# EAGLE design edubrm (EAGLE 5.11)
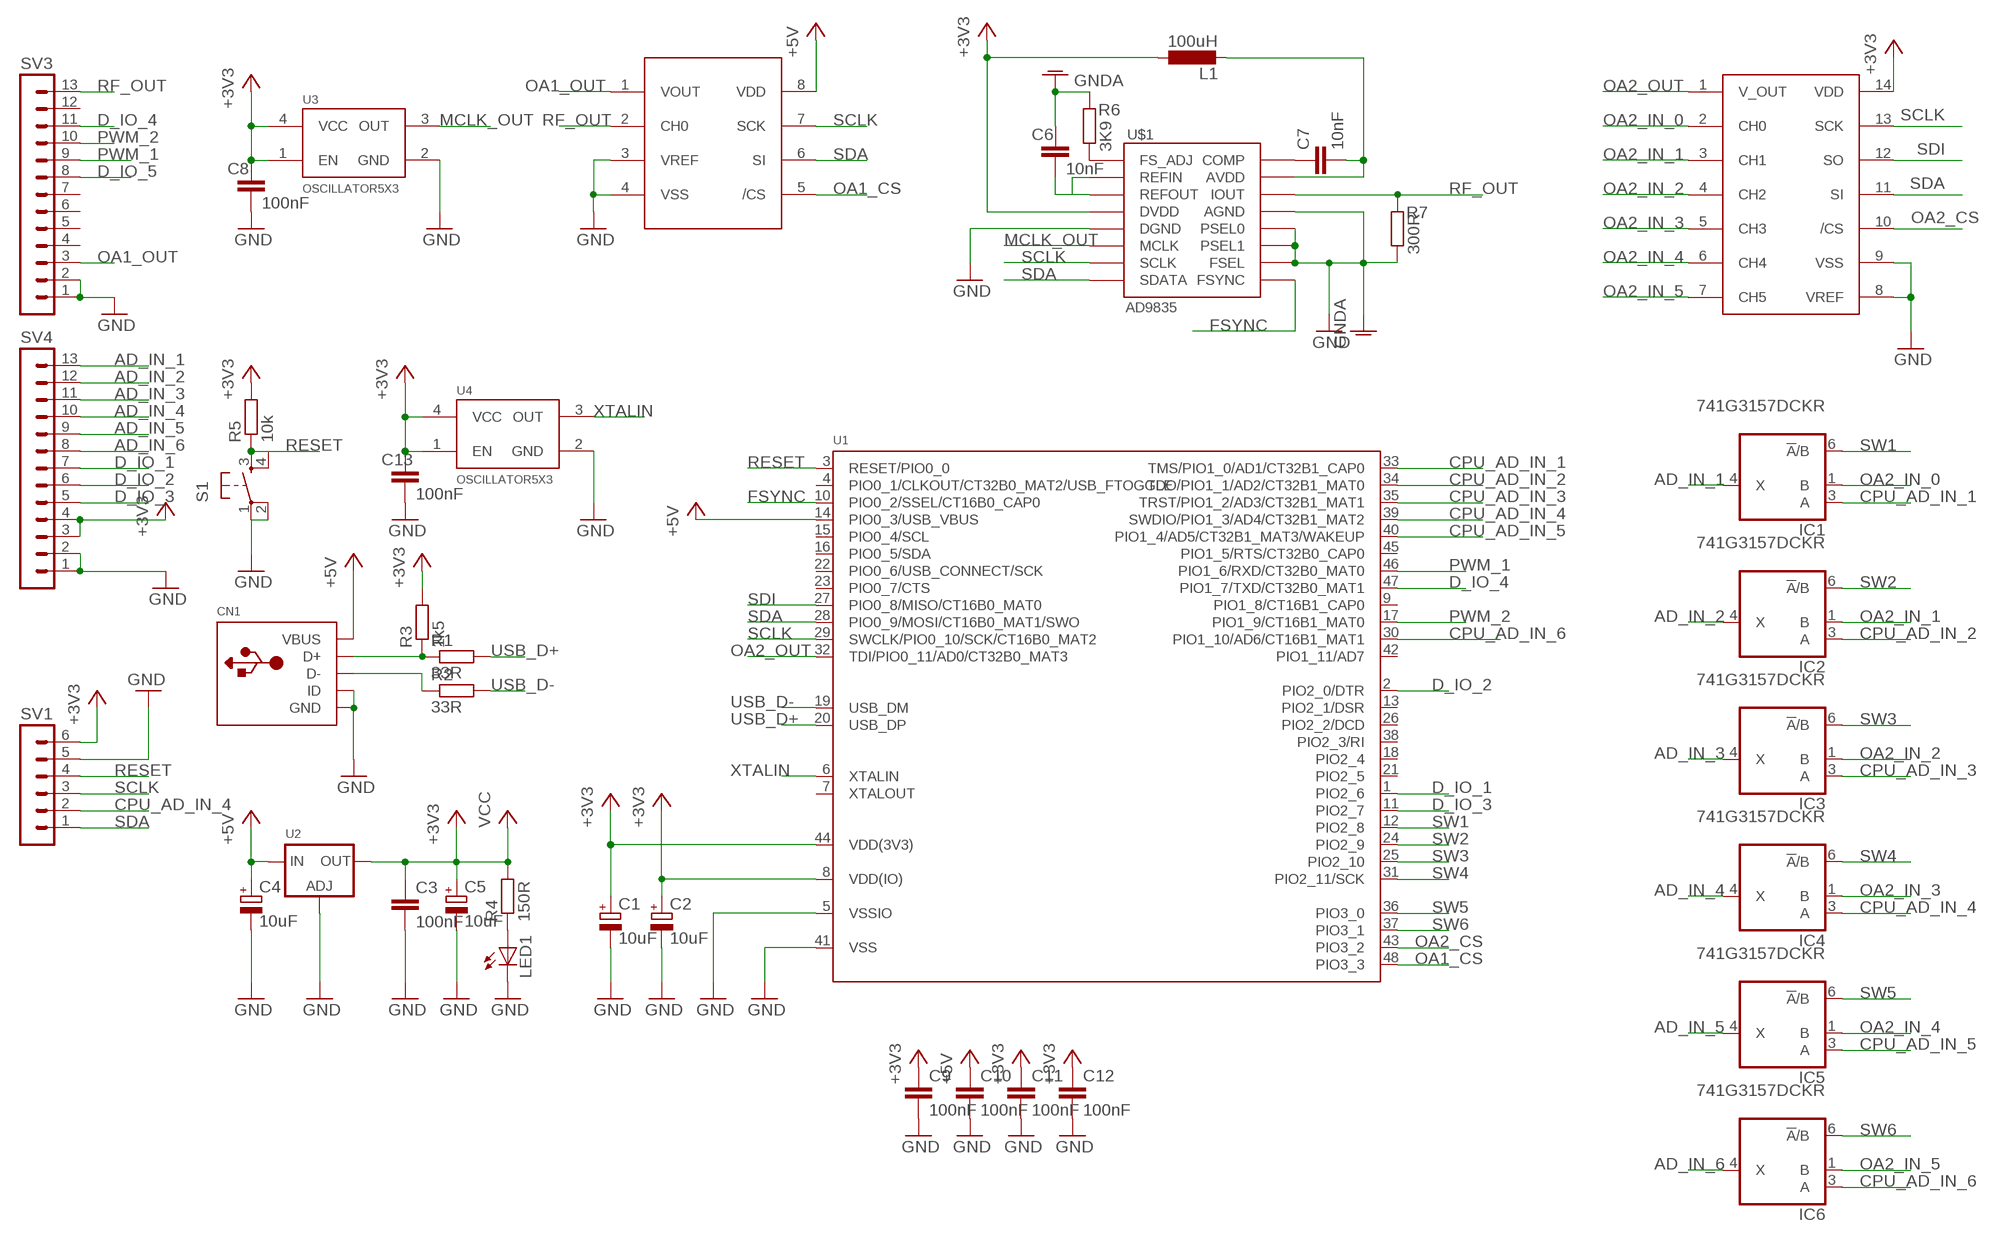
[diagram p0: schematic, sheet 1]

## Parts
C1  10uF  CPOL-EUSMCB  [SMC_B]
C2  10uF  CPOL-EUSMCB  [SMC_B]
C3  100nF  C-EUC1206  [C1206]
C4  10uF  CPOL-EUSMCB  [SMC_B]
C5  10uF  CPOL-EUSMCB  [SMC_B]
C6  10nF  C-EUC1206  [C1206]
C7  10nF  C-EUC1206  [C1206]
C8  100nF  C-EUC1206  [C1206]
C9  100nF  C-EUC1206  [C1206]
C10  100nF  C-EUC1206  [C1206]
C11  100nF  C-EUC1206  [C1206]
C12  100nF  C-EUC1206  [C1206]
C13  100nF  C-EUC1206  [C1206]
CN1  USBMINIB  [USB-MINIB]
IC1  741G3157DCKR  [DCK_R-PDSO-G6]
IC2  741G3157DCKR  [DCK_R-PDSO-G6]
IC3  741G3157DCKR  [DCK_R-PDSO-G6]
IC4  741G3157DCKR  [DCK_R-PDSO-G6]
IC5  741G3157DCKR  [DCK_R-PDSO-G6]
IC6  741G3157DCKR  [DCK_R-PDSO-G6]
L1  100uH  L-EUL1812  [L1812]
LED1  LEDCHIPLED_1206  [CHIPLED_1206]
R1  33R  R-EU_R1206  [R1206]
R2  33R  R-EU_R1206  [R1206]
R3  1k5  R-EU_R1206  [R1206]
R4  150R  R-EU_R1206  [R1206]
R5  10k  R-EU_R1206  [R1206]
R6  3K9  R-EU_R1206  [R1206]
R7  300R  R-EU_R1206  [R1206]
S1  TAC_SWITCHSMD  [TACTILE_SWITCH_SMD]
SV1  MA06-1  [MA06-1]
SV3  MA13-1  [MA13-1]
SV4  MA13-1  [MA13-1]
U1  LPC1343_QFP  [LQFP48]
U2  LM1117SOT223-REFLOW  [SOT223-R]
U3  OSCILLATOR5X3  [CRYSTAL-SMD-5X3]
U4  OSCILLATOR5X3  [CRYSTAL-SMD-5X3]
U$1  AD9835  [TSSOP16]
U$2  MCP6S21-SO8  [SO08]
U$3  MCP6S26-SO14  [SO14]

## Nets
+3V3: SV1.6
+5V: C4.+ C10.1 CN1.VBUS U1.14(PIO0_3/USB_VBUS) U2.3(IN) U$2.8(VDD)
AD_IN_1: IC1.4(X) SV4.13
AD_IN_2: IC2.4(X) SV4.12
AD_IN_3: IC3.4(X) SV4.11
AD_IN_4: IC4.4(X) SV4.10
AD_IN_5: IC5.4(X) SV4.9
AD_IN_6: IC6.4(X) SV4.8
CPU_AD_IN_1: IC1.3(A) U1.33(TMS/PIO1_0/AD1/CT32B1_CAP0)
CPU_AD_IN_2: IC2.3(A) U1.34(TDO/PIO1_1/AD2/CT32B1_MAT0)
CPU_AD_IN_3: IC3.3(A) U1.35(TRST/PIO1_2/AD3/CT32B1_MAT1)
CPU_AD_IN_4: IC4.3(A) SV1.2 U1.39(SWDIO/PIO1_3/AD4/CT32B1_MAT2)
CPU_AD_IN_5: IC5.3(A) U1.40(PIO1_4/AD5/CT32B1_MAT3/WAKEUP)
CPU_AD_IN_6: IC6.3(A) U1.30(PIO1_10/AD6/CT16B1_MAT1)
D_IO_1: SV4.7 U1.1(PIO2_6)
D_IO_2: SV4.6 U1.2(PIO2_0/DTR)
D_IO_3: SV4.5 U1.11(PIO2_7)
D_IO_4: SV3.11 U1.47(PIO1_7/TXD/CT32B0_MAT1)
D_IO_5: SV3.8
FSYNC: U1.10(PIO0_2/SSEL/CT16B0_CAP0) U$1.9(FSYNC)
GND: C1.- C2.- C3.2 C4.- C5.- C8.2 C9.2 C10.2 C11.2 C12.2 C13.2 CN1.GND CN1.ID LED1.C R7.1 S1.1 S1.2 SV1.5 SV3.1 SV3.2 SV4.1 SV4.2 U1.5(VSSIO) U1.41(VSS) U2.1(ADJ) U3.2(GND) U4.2(GND) U$1.5(DGND) U$1.10(FSEL) U$1.11(PSEL1) U$1.12(PSEL0) U$1.13(AGND) U$2.3(VREF) U$2.4(VSS) U$3.8(VREF) U$3.9(VSS) ; supply symbol labelled GNDA
GNDA: C6.1 R6.2
MCLK_OUT: U3.3(OUT) U$1.6(MCLK)
N$1: CN1.D- R2.1
N$2: CN1.D+ R1.1 R3.1
N$4: LED1.A R4.1
N$5: C7.2 L1.2 U$1.15(AVDD)
N$7: C6.2 U$1.2(REFIN) U$1.3(REFOUT)
N$8: C7.1 U$1.16(COMP)
N$9: R6.1 U$1.1(FS_ADJ)
OA1_CS: U1.48(PIO3_3) U$2.5(/CS)
OA1_OUT: SV3.3 U$2.1(VOUT)
OA2_CS: U1.43(PIO3_2) U$3.10(/CS)
OA2_IN_0: IC1.1(B) U$3.2(CH0)
OA2_IN_1: IC2.1(B) U$3.3(CH1)
OA2_IN_2: IC3.1(B) U$3.4(CH2)
OA2_IN_3: IC4.1(B) U$3.5(CH3)
OA2_IN_4: IC5.1(B) U$3.6(CH4)
OA2_IN_5: IC6.1(B) U$3.7(CH5)
OA2_OUT: U1.32(TDI/PIO0_11/AD0/CT32B0_MAT3) U$3.1(V_OUT)
PWM_1: SV3.9 U1.46(PIO1_6/RXD/CT32B0_MAT0)
PWM_2: SV3.10 U1.17(PIO1_9/CT16B1_MAT0)
RESET: R5.1 S1.3 S1.4 SV1.4 U1.3(RESET/PIO0_0)
RF_OUT: R7.2 SV3.13 U$1.14(IOUT) U$2.2(CH0)
SCLK: SV1.3 U1.29(SWCLK/PIO0_10/SCK/CT16B0_MAT2) U$1.7(SCLK) U$2.7(SCK) U$3.13(SCK)
SDA: SV1.1 U1.28(PIO0_9/MOSI/CT16B0_MAT1/SWO) U$1.8(SDATA) U$2.6(SI) U$3.11(SI)
SDI: U1.27(PIO0_8/MISO/CT16B0_MAT0) U$3.12(SO)
SW1: IC1.6(!A!/B) U1.12(PIO2_8)
SW2: IC2.6(!A!/B) U1.24(PIO2_9)
SW3: IC3.6(!A!/B) U1.25(PIO2_10)
SW4: IC4.6(!A!/B) U1.31(PIO2_11/SCK)
SW5: IC5.6(!A!/B) U1.36(PIO3_0)
SW6: IC6.6(!A!/B) U1.37(PIO3_1)
USB_D+: R1.2 U1.20(USB_DP)
USB_D-: R2.2 U1.19(USB_DM)
VCC: C1.+ C2.+ C3.1 C5.+ C8.1 C9.1 C11.1 C12.1 C13.1 L1.1 R3.2 R4.2 R5.2 SV4.3 SV4.4 U1.8(VDD(IO)) U1.44(VDD(3V3)) U2.2(OUT) U3.1(EN) U3.4(VCC) U4.1(EN) U4.4(VCC) U$1.4(DVDD) U$3.14(VDD) ; supply symbol labelled +3V3
XTALIN: U1.6(XTALIN) U4.3(OUT)
Unconnected: SV3.4 SV3.5 SV3.6 SV3.7 SV3.12 U1.4(PIO0_1/CLKOUT/CT32B0_MAT2/USB_FTOGGLE) U1.7(XTALOUT) U1.9(PIO1_8/CT16B1_CAP0) U1.13(PIO2_1/DSR) U1.15(PIO0_4/SCL) U1.16(PIO0_5/SDA) U1.18(PIO2_4) U1.21(PIO2_5) U1.22(PIO0_6/USB_CONNECT/SCK) U1.23(PIO0_7/CTS) U1.26(PIO2_2/DCD) U1.38(PIO2_3/RI) U1.42(PIO1_11/AD7) U1.45(PIO1_5/RTS/CT32B0_CAP0)

## Power pins joined to a net without a drawn wire
GND: IC1.2(GND) IC2.2(GND) IC3.2(GND) IC4.2(GND) IC5.2(GND) IC6.2(GND)
VCC: IC1.5(VCC) IC2.5(VCC) IC3.5(VCC) IC4.5(VCC) IC5.5(VCC) IC6.5(VCC)

## Library data of the parts
C1 C2 C4 C5 = rcl:CPOL-EU: POLARIZED CAPACITOR, European symbol
C3 C6-C13 = rcl:C-EU: CAPACITOR, European symbol
CN1 = adafruit:USB: USB Connectors USBMINIB - Surface Mount Female Mini-B USB Connector 4UConnector: 06564 By microbuilder.eu Thru-hole RA Female Mini-B USB Connector 4UConnector: 18732 By ladyada.net
IC1-IC6 = 74xx-little-de:74*1G3157: Single-Pole, Double-Throw Analog Switch Source: http://focus.ti.com/lit/ds/symlink/sn74lvc1g3157.pdf
L1 = rcl:L-EU: INDUCTOR, European symbol
LED1 = led:LED: LED OSRAM: - CHIPLED LG R971, LG N971, LY N971, LG Q971, LY Q971, LO R971, LY R971 LH N974, LH R974 LS Q976, LO Q976, LY Q976 LO Q996 - Hyper CHIPLED LW Q18S LB Q993, LB Q99A, LB R99A - SideLED LS A670, LO A670, LY A670, LG A670, LP A670 LB A673, LV A673, LT A673, LW A673 LH A674 LY A675 LS A676, LA A676, LO A676, LY A676, LW A676 LS A679, LY A679, LG A679 - Hyper Micro SIDELED® LS Y876, LA Y876, LO Y876, LY Y876 LT Y87S - SmartLED LW L88C, LW L88S LB L89C, LB L89S, LG L890 LS L89K, LO L89K, LY L89K LS L896, LA L896, LO L896, LY L896 - TOPLED LS T670, LO T670, LY T670, LG T670, LP T670 LSG T670, LSP T670, LSY T670, LOP T670, LYG T670 LG T671, LOG T671, LSG T671 LB T673, LV T673, LT T673, LW T673 LH T674 LS T676, LA T676, LO T676, LY T676, LB T676, LH T676, LSB T676, LW T676 LB T67C, LV T67C, LT T67C, LS T67K, LO T67K, LY T67K, LW E67C LS E67B, LA E67B, LO E67B, LY E67B, LB E67C, LV E67C, LT E67C LW T67C LS T679, LY T679, LG T679 LS T770, LO T770, LY T770, LG T770, LP T770 LB T773, LV T773, LT T773, LW T773 LH T774 LS E675, LA E675, LY E675, LS T675 LS T776, LA T776, LO T776, LY T776, LB T776 LHGB T686 LT T68C, LB T68C - Hyper Mini TOPLED® LB M676 - Mini TOPLED Santana® LG M470 LS M47K, LO M47K, LY M47K Source: http://www.osram.convergy.de LUXEON: - LUMILED® LXK2-PW12-R00, LXK2-PW12-S00, LXK2-PW14-U00, LXK2-PW14-V00 LXK2-PM12-R00, LXK2-PM12-S00, LXK2-PM14-U00 LXK2-PE12-Q00, LXK2-PE12-R00, LXK2-PE12-S00, LXK2-PE14-T00, LXK2-PE14-U00 LXK2-PB12-K00, LXK2-PB12-L00, LXK2-PB12-M00, LXK2-PB14-N00, LXK2-PB14-P00, LXK2-PB14-Q00 LXK2-PR12-L00, LXK2-PR12-M00, LXK2-PR14-Q00, LXK2-PR14-R00 LXK2-PD12-Q00, LXK2-PD12-R00, LXK2-PD12-S00 LXK2-PH12-R00, LXK2-PH12-S00 LXK2-PL12-P00, LXK2-PL12-Q00, LXK2-PL12-R00 Source: www.luxeon.com KINGBRIGHT: KA-3528ASYC Source: www.kingbright.com
R1-R7 = rcl:R-EU_: RESISTOR, European symbol
S1 = SparkFun:TAC_SWITCH: Momentary Switch Button commonly used for reset or general input. Spark Fun Electronics SKU : COM-00097
SV1 = con-lstb:MA06-1: PIN HEADER; OC_FARNELL: unknown; OC_NEWARK: unknown
SV3 SV4 = con-lstb:MA13-1: PIN HEADER; OC_FARNELL: unknown; OC_NEWARK: unknown
U1 = microbuilder:LPC1343_QFP: LPC1343 72 MHz 32-bit ARM Cortex-M3 microcontroller. 32 kB Flash, 8 kB SRAM, USB Device Mouser: 771-LPC1343FBD48151 Digikey: 568-4945-ND
U2 = microbuilder:LM1117: LM1117 Voltage Regulator LM1117 Adjustable Voltage regulator [Digikey: LM1117IMP-ADJDKR-ND] LM1117 3.3V Voltage regulator [AP1117E33GDIDKR-ND] LM1117 5.0V Voltage regulator [AP1117E50GDIDKR-ND] SOT223-REFLOW - SOT223 package for solder paste/reflow ovens SOT223-WAVE - SOT223 package for hand-soldering (larger pads) Note: For the fixed-voltage regulators, simply set the ADJ pin to GND.
U3 U4 = SparkFun:OSCILLATOR
U$1 = SparkFun:AD9835
U$2 = sargon-parts:MCP6S21-SO8
U$3 = sargon-parts:MCP6S26-SO14

## Board
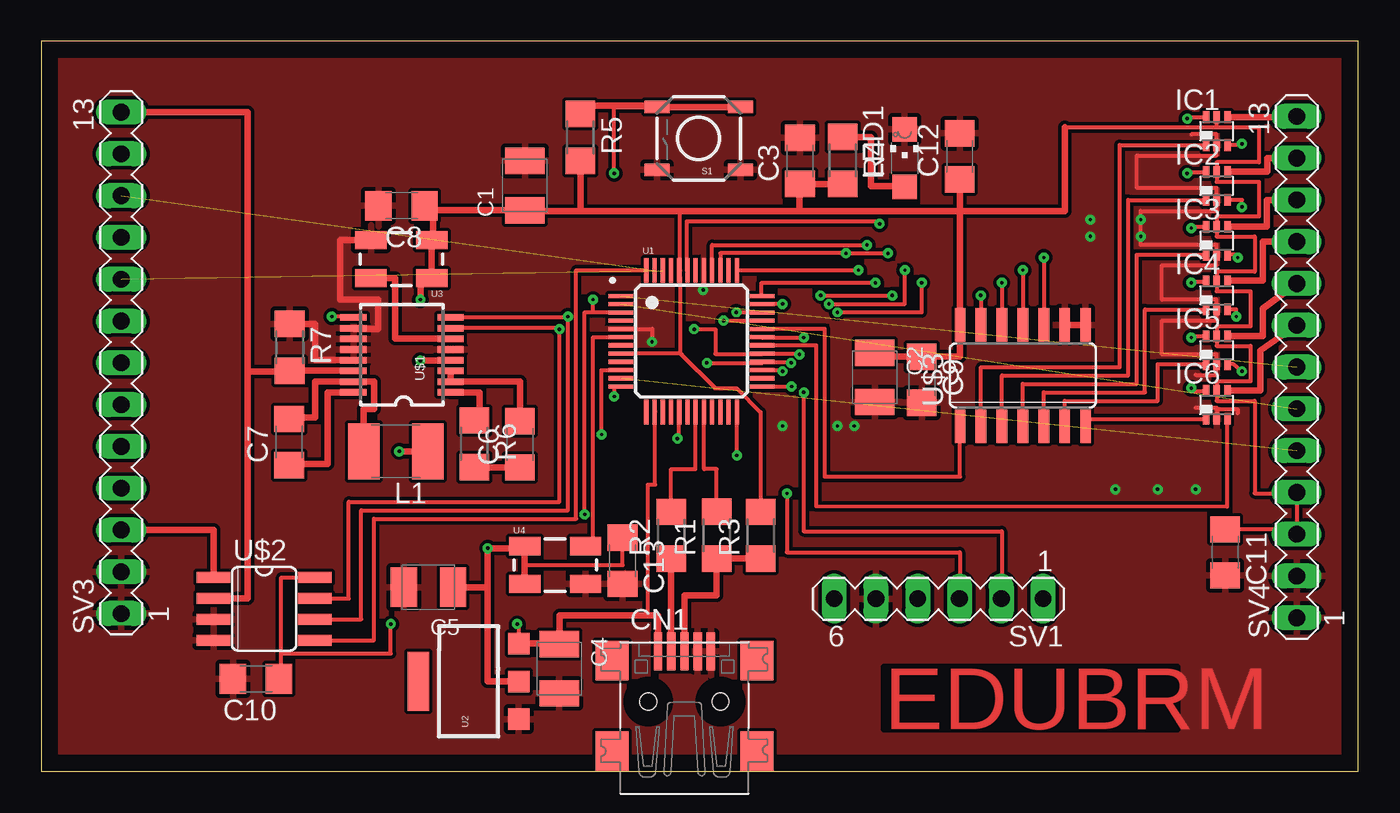
[diagram p1: board, top side]
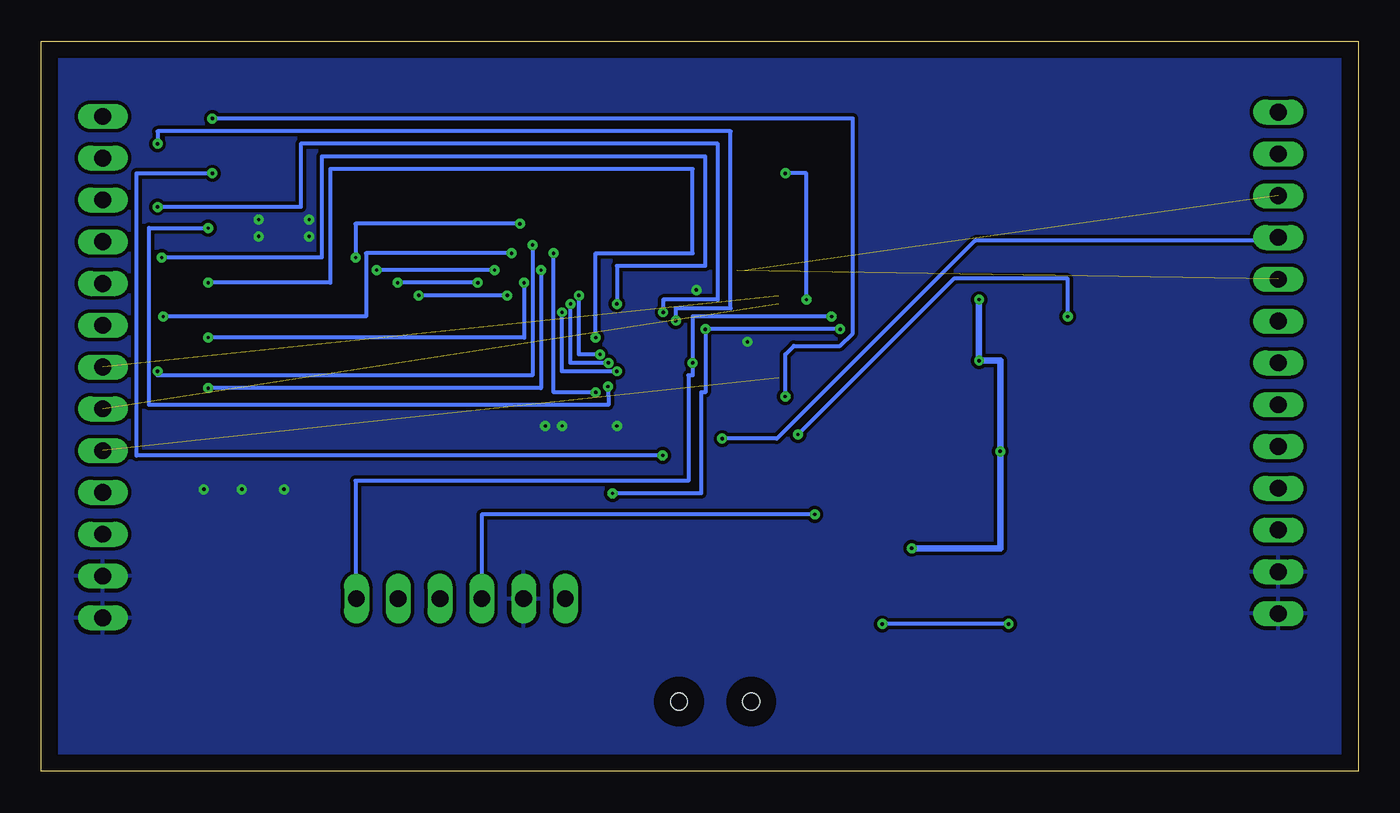
[diagram p2: board, bottom side, seen from below]

Size 80.03 x 44.38 mm. Coordinates in mm from the lower left corner, seen from the top.
Outline: 0,0 80.03,0 80.03,44.38 0,44.38 0,0
Copper layers (1*16): Top 0.035mm / dielectric 1.5mm / Bottom 0.035mm
Design rules "default *": minimum track width 10mil, minimum drill 24mil, track to track 8mil, track to pad 8mil, pad to pad 8mil, via to via 8mil, smd to smd 8mil, copper to edge 40mil, drill to drill 8mil, minimum pad ring 10mil, minimum via ring 8mil, stop-mask expansion 4mil, vias tented up to drill 0mil, thermal gap 10mil

### Footprints (pad centres in the part's own frame; a part is rotated, then mirrored left to right if it is on the bottom)
SMC_B = smd 1.6 x 2.4: + -1.5,0; - 1.5,0
C1206 = smd 1.6 x 1.8: 1 -1.4,0; 2 1.4,0
USB-MINIB = smd 0.5 x 2.308: D+ 0,4.064; D- -0.8,4.064; GND 1.6,4.064; ID 0.8,4.064; VBUS -1.6,4.064 | smd 2 x 2.4: GND1 -4.4,-2; GND2 -4.4,3.5; GND3 4.4,3.5; GND4 4.4,-2 | hole 1: -2.2,1; 2.2,1
DCK_R-PDSO-G6 = smd 0.4 x 0.7: 1 -0.65,-0.85; 2 0,-0.85; 3 0.65,-0.85; 4 0.65,0.85; 5 0,0.85; 6 -0.65,0.85
L1812 = smd 1.9 x 3.4: 1 -1.95,0; 2 1.95,0
CHIPLED_1206 = smd 1.5 x 1.5: A 0,-1.75; C 0,1.75
R1206 = smd 1.6 x 1.803: 1 -1.422,0; 2 1.422,0
TACTILE_SWITCH_SMD = smd 1.524 x 0.762: 1 -2.54,1.905; 2 2.54,1.905; 3 -2.54,-1.905; 4 2.54,-1.905
MA06-1 = drill 1.016 long: 1 -6.35,0; 2 -3.81,0; 3 -1.27,0; 4 1.27,0; 5 3.81,0; 6 6.35,0
MA13-1 = drill 1.016 long: 1 -15.24,0; 2 -12.7,0; 3 -10.16,0; 4 -7.62,0; 5 -5.08,0; 6 -2.54,0; 7 0,0; 8 2.54,0; 9 5.08,0; 10 7.62,0; 11 10.16,0; 12 12.7,0; 13 15.24,0
LQFP48 = smd 1.5 x 0.25: 1 -4.3,2.75; 2 -4.3,2.25; 3 -4.3,1.75; 4 -4.3,1.25; 5 -4.3,0.75; 6 -4.3,0.25; 7 -4.3,-0.25; 8 -4.3,-0.75; 9 -4.3,-1.25; 10 -4.3,-1.75; 11 -4.3,-2.25; 12 -4.3,-2.75; 25 4.3,-2.75; 26 4.3,-2.25; 27 4.3,-1.75; 28 4.3,-1.25; 29 4.3,-0.75; 30 4.3,-0.25; 31 4.3,0.25; 32 4.3,0.75; 33 4.3,1.25; 34 4.3,1.75; 35 4.3,2.25; 36 4.3,2.75 | smd 0.25 x 1.5: 13 -2.75,-4.3; 14 -2.25,-4.3; 15 -1.75,-4.3; 16 -1.25,-4.3; 17 -0.75,-4.3; 18 -0.25,-4.3; 19 0.25,-4.3; 20 0.75,-4.3; 21 1.25,-4.3; 22 1.75,-4.3; 23 2.25,-4.3; 24 2.75,-4.3; 37 2.75,4.3; 38 2.25,4.3; 39 1.75,4.3; 40 1.25,4.3; 41 0.75,4.3; 42 0.25,4.3; 43 -0.25,4.3; 44 -0.75,4.3; 45 -1.25,4.3; 46 -1.75,4.3; 47 -2.25,4.3; 48 -2.75,4.3
SOT223-R = smd 1.3 x 1.3: 1 -2.3,-3.05; 2 0,-3.05; 3 2.3,-3.05 | smd 3.6 x 1.3: 4 0,3.05
CRYSTAL-SMD-5X3 = smd 1.9 x 1.1: 1 -1.85,-1.15; 2 1.85,-1.15; 3 1.85,1.15; 4 -1.85,1.15
TSSOP16 = smd 0.4 x 1.6: 1 -2.225,-2.85; 2 -1.575,-2.85; 3 -0.925,-2.85; 4 -0.275,-2.85; 5 0.375,-2.85; 6 1.025,-2.85; 7 1.675,-2.85; 8 2.325,-2.85; 9 2.325,3.05; 10 1.675,3.05; 11 1.025,3.05; 12 0.375,3.05; 13 -0.275,3.05; 14 -0.925,3.05; 15 -1.575,3.05; 16 -2.225,3.05
SO08 = smd 0.66 x 2.032: 1 -1.905,-3.073; 2 -0.635,-3.073; 3 0.635,-3.073; 4 1.905,-3.073; 5 1.905,3.073; 6 0.635,3.073; 7 -0.635,3.073; 8 -1.905,3.073
SO14 = smd 0.66 x 2.032: 1 -3.81,-3.073; 2 -2.54,-3.073; 3 -1.27,-3.073; 4 0,-3.073; 5 1.27,-3.073; 6 2.54,-3.073; 7 3.81,-3.073; 8 3.81,3.073; 9 2.54,3.073; 10 1.27,3.073; 11 0,3.073; 12 -1.27,3.073; 13 -2.54,3.073; 14 -3.81,3.073

### Placement (x,y rotation side)
C1  29.4,35.61 90 top
C2  50.65,23.95 270 top
C3  46.11,37.11 90 top
C4  31.48,6.25 270 top
C5  23.53,11.19 180 top
C6  29.09,19.88 90 top
C7  15.07,20.02 90 top
C8  21.89,34.38 180 top
C9  53.5,23.81 270 top
C10  13.06,5.63 180 top
C11  71.94,13.31 270 top
C12  55.81,37.38 90 top
C13  35.33,12.8 270 top
CN1  39.09,3.25 0 top
IC1  71.42,38.91 0 top
IC2  71.42,35.58 0 top
IC3  71.42,32.26 0 top
IC4  71.42,28.93 0 top
IC5  71.42,25.6 0 top
IC6  71.42,22.27 0 top
L1  21.55,19.45 180 top
LED1  52.46,37.27 0 top
R1  41.04,14.36 90 top
R2  38.28,14.35 90 top
R3  43.72,14.35 90 top
R4  48.7,37.13 270 top
R5  32.76,38.54 270 top
R6  26.32,19.91 270 top
R7  15.09,25.78 270 top
S1  39.95,38.47 180 top
SV1  54.53,10.5 180 top
SV3  4.86,24.83 90 top
SV4  76.29,24.58 90 top
U1  39.52,26.15 0 top
U2  25.96,5.47 90 top
U3  21.89,31.14 180 top
U4  31.23,12.54 0 top
U$1  22.02,25.27 90 top
U$2  13.55,9.88 270 top
U$3  59.65,24.06 0 top

### Tracks (layer width: path | path; a pad name or v marks a point on that pad's centre or on a via)
+5V  (via drill 0.2)
  Top 0.254: U1.14 37.3,21.85 37.3,17.43 36.86,17.43 36.86,9.47 | U$2.8 14.59,11.79 14.59,7.17 | 14.59,7.17 21.25,7.17 v21.25,8.96 | v28.93,8.96 29.02,8.96 U2.3 | C10.1 14.59,5.63 14.59,7.17
  Top 0.406: U2.3 31.48,7.77 C4.+ 31.49,7.75 31.49,9.47 36.86,9.47 37.49,9.47 CN1.VBUS
  Bottom 0.254: v21.25,8.96 v28.93,8.96
AD_IN_1
  Top 0.406: IC1.4 76.29,39.76 SV4.13
AD_IN_2
  Top 0.406: SV4.12 74.49,37.28 74.49,36.45 IC2.4
AD_IN_3
  Top 0.406: IC3.4 74.46,33.11 74.46,34.73 SV4.11
AD_IN_4
  Top 0.406: SV4.10 74.24,32.2 74.24,29.84 72.07,29.84 IC4.4
AD_IN_5
  Top 0.406: SV4.9 74.24,28.12 74.24,26.48 72.07,26.48 IC5.4
AD_IN_6
  Top 0.406: SV4.8 74.07,25.58 74.07,23.14 72.07,23.14 IC6.4
CPU_AD_IN_1  (via drill 0.2)
  Top 0.254: IC1.3 72.96,38.06 v72.96,38.14 | v41.47,27.39 U1.33
  Bottom 0.254: v72.96,38.14 72.96,38.91 38.14,38.91 38.14,28.16 41.47,28.16 v41.47,27.39
CPU_AD_IN_2  (via drill 0.2)
  Top 0.254: IC2.3 72.96,34.73 v72.96,34.3 | v42.24,27.9 U1.34
  Bottom 0.254: v72.96,34.3 64.26,34.3 64.26,38.14 38.91,38.14 38.91,28.67 42.24,28.67 v42.24,27.9
CPU_AD_IN_3  (via drill 0.2)
  Top 0.254: IC3.3 72.7,31.41 v72.7,31.23 | v45.06,28.42 43.82,28.42 U1.35
  Bottom 0.254: v72.7,31.23 62.98,31.23 62.98,37.38 39.68,37.38 39.68,30.72 45.06,30.72 v45.06,28.42
CPU_AD_IN_4  (via drill 0.2)
  Top 0.254: IC4.3 72.61,28.08 72.61,27.97 v72.61,27.65 | v51.46,31.49 v48.9,31.49 48.64,31.49 41.27,31.49 U1.39 | SV1.2 58.37,10.5 58.37,14.59 46.34,14.59 v46.34,23.04
  Bottom 0.254: v72.61,27.65 60.29,27.65 60.29,31.49 v51.46,31.49 | v46.34,23.04 48.9,23.04 v48.9,31.49
CPU_AD_IN_5  (via drill 0.2)
  Top 0.254: IC5.3 72.45,24.75 v72.96,24.32 | v50.18,32 40.77,32 U1.40
  Bottom 0.254: v72.96,24.32 72.96,24.06 50.18,24.06 v50.18,32
CPU_AD_IN_6
  Top 0.254: IC6.3 72.06,21.39 72.06,16.1 47.1,16.13 47.1,25.89 U1.30
D_IO_1  (1 unrouted)
D_IO_2  (1 unrouted)
D_IO_3  (1 unrouted)
D_IO_4  (1 unrouted)
FSYNC  (via drill 0.2)
  Top 0.254: U1.10 34.05,24.4 v34.05,20.48 | v17.66,27.65 18.92,27.65 U$1.9
  Bottom 0.254: v34.05,20.48 24.58,29.95 17.66,29.95 v17.66,27.65
GND  (via drill 0.2)
  Top 0.254: 69.89,38.72 71.42,38.72 IC1.2 71.4,38.06 71.4,37.43 66.58,37.43 66.58,35.46 71.42,35.46 IC2.2 71.44,34.73 71.44,34.06 66.82,34.06 v66.82,33.54 66.82,32 71.42,32 IC3.2 71.4,31.41 71.4,30.76 68.1,30.76 68.1,28.67 71.42,28.67 IC4.2 71.44,28.08 71.44,27.4 68.1,27.4 68.1,25.34 71.42,25.34 IC5.2 71.4,24.75 71.4,24.09 70.14,24.09 | 70.14,22.11 71.42,22.11 71.42,22.02 | 71.42,22.02 IC6.2 | 71.42,22.02 72.7,22.02 72.7,21.76 | U1.5 37.12,26.9 v37.12,26.11 | v40.23,29.27 40.27,29.27 U1.41
  Top 0.406: U3.2 18.18,32.29 18.18,28.67 20.48,28.67 20.48,26.88 18.97,26.88 U$1.10 | R7.1 16.64,27.2 16.64,24.99 U$1.13 | U$3.9 U$3.8
  other vias: 63.74,33.54 48.38,20.99 49.41,20.99 45.06,20.99 65.28,17.15 67.84,17.15 70.14,17.15 63.74,32.51 66.82,32.51
  pour Top: -1.02,46.08 81.15,46.08 81.15,-1.02 -1.02,-1.02
  pour Bottom: 80.9,44.8 80.9,-0.77 -0.51,-0.77 -0.51,45.06
GNDA
  Top 0.406: C6.1 27.35,18.48 R6.2
MCLK_OUT
  Top 0.406: U3.3 21.5,29.99 21.5,26.3 24.87,26.3 U$1.6
N$1
  Top 0.406: CN1.D- 38.28,7.82 R2.1
N$2
  Top 0.406: CN1.D+ 39.08,7.82 39.08,10.7 41.04,10.7 R1.1 R3.1
N$4
  Top 0.406: R4.1 50.43,38.55 50.43,35.58 52.21,35.58 LED1.A
N$5
  Top 0.406: C7.2 15.07,21.5 16.64,21.5 16.64,23.69 U$1.15 20.22,23.69 20.22,22.02 19.6,22.02 L1.2
N$7
  Top 0.406: U$1.3 U$1.2 29.09,23.69 C6.2
N$8
  Top 0.406: U$1.16 17.41,23.04 17.41,18.69 15.07,18.69 C7.1
N$9
  Top 0.406: R6.1 26.62,21.33 26.62,23.04 U$1.1
OA1_CS
  Top 0.254: U$2.5 20.22,7.98 20.22,15.36 32.51,15.36 32.51,30.46 36.77,30.46 U1.48
OA1_OUT
  Top 0.406: SV3.3 10.47,14.67 U$2.1
OA2_CS  (via drill 0.2)
  Top 0.254: U1.43 39.24,30.45 39.24,33.43 50.94,33.43 v50.94,33.28 | v60.93,31.23 v60.92,31.23 U$3.10
  Bottom 0.254: v50.94,33.28 60.93,33.28 v60.93,31.23
OA2_IN_0
  Top 0.254: IC1.1 65.54,38.06 65.54,24.58 57.11,24.58 U$3.2
OA2_IN_1
  Top 0.254: IC2.1 66.05,34.73 66.05,24.06 58.38,24.06 U$3.3
OA2_IN_2
  Top 0.254: IC3.1 66.56,31.41 66.56,23.55 59.65,23.55 U$3.4
OA2_IN_3
  Top 0.254: IC4.1 67.07,28.08 67.07,23.04 60.92,23.04 U$3.5
OA2_IN_4
  Top 0.254: IC5.1 67.84,24.75 67.84,22.53 62.19,22.53 U$3.6
OA2_IN_5
  Top 0.254: IC6.1 63.46,21.42 U$3.7
OA2_OUT
  Top 0.254: U1.32 47.62,26.9 47.62,17.92 55.84,17.92 U$3.1
PWM_1  (1 unrouted)
PWM_2  (via drill 0.2)
  Top 0.254: U1.17 38.77,20.34 v38.66,20.22
  Bottom 0.254: v38.66,20.22 35.33,20.22 23.3,32.26 5.06,32.26 SV3.10
RESET  (via drill 0.2)
  Top 0.254: S1.4 36.86,40.38 34.82,40.38 v34.82,36.35 | 33.54,27.9 v33.54,28.67 | 33.54,27.9 U1.3 | 33.54,27.9 33.02,27.9 v33.02,15.62
  Top 0.406: S1.4 S1.3 | R5.1 33.02,39.96 33.02,40.45 36.86,40.45 36.86,40.38
  Bottom 0.254: v33.54,28.67 33.54,36.35 v34.82,36.35 | v33.02,15.62 53.26,15.62 SV1.4
RF_OUT
  Top 0.406: U$1.14 18.97,24.36 R7.2 15.1,24.32 12.54,24.32 | U$2.2 12.54,10.52 12.54,24.32 | SV3.13 12.54,40.07 12.54,24.32
SCLK  (via drill 0.2)
  Top 0.254: U$1.7 31.49,26.94 v31.49,26.88 31.49,16.38 18.69,16.38 18.69,10.52 U$2.7 | v39.68,26.88 40.96,26.88 40.96,25.38 43.82,25.38 U1.29 46.08,25.4 v46.08,25.34 | v47.36,28.93 v51.71,28.93 | v57.09,28.93 57.11,28.93 U$3.13 | SV1.3 55.81,10.5 55.81,13.31 45.31,13.31 v45.31,16.9
  Bottom 0.254: v31.49,26.88 v39.68,26.88 39.68,23.04 39.94,23.04 39.94,16.9 v45.31,16.9 | v46.08,25.34 47.36,25.34 v47.36,28.93 | v51.71,28.93 v57.09,28.93
SDA  (via drill 0.2)
  Top 0.254: 32,27.59 U$1.8 | v40.45,24.83 43.82,24.83 U1.28 45.57,24.9 v45.57,24.83 | U$2.6 19.46,9.25 19.46,15.87 32,15.87 32,27.59 | 32,27.59 v32,27.65 | v59.65,30.46 U$3.11 | v47.87,28.42 52.48,28.42 v52.48,30.46
  Bottom 0.254: v32,27.65 40.45,27.65 v40.45,24.83 40.45,24.06 40.7,24.06 40.7,17.66 60.93,17.66 60.93,10.5 SV1.1 | v45.57,24.83 47.87,24.83 v47.87,28.42 | v52.48,30.46 v59.65,30.46
SDI  (via drill 0.2)
  Top 0.254: U$3.12 v58.37,29.7 | U1.27 45.06,24.4 v45.06,24.32 | v48.38,27.9 53.5,27.9 v53.5,29.7
  Bottom 0.254: v45.06,24.32 48.38,24.32 v48.38,27.9 | v53.5,29.7 v58.37,29.7
SW1  (via drill 0.2)
  Top 0.254: IC1.6 69.63,39.76 v69.63,39.68 | v34.82,22.78 34.8,23.4 U1.12
  Bottom 0.254: v69.63,39.68 30.72,39.68 30.72,26.62 31.49,25.86 34.3,25.86 34.82,25.34 v34.82,22.78
SW2  (via drill 0.2)
  Top 0.254: IC2.6 69.63,36.43 v69.63,36.35 | v42.27,19.2 42.27,20.99 U1.24
  Bottom 0.254: v69.63,36.35 74.24,36.35 74.24,19.2 v42.27,19.2
SW3  (via drill 0.2)
  Top 0.254: IC3.6 69.89,33.11 v69.89,33.02 | v45.6,23.39 43.85,23.39 U1.25
  Bottom 0.254: v69.89,33.02 73.47,33.02 73.47,22.27 45.57,22.27 v45.6,23.39
SW4  (via drill 0.2)
  Top 0.254: IC4.6 69.89,29.78 v69.89,29.7 | v46.34,26.37 43.82,26.37 U1.31
  Bottom 0.254: v69.89,29.7 62.46,29.7 62.46,36.61 40.45,36.61 40.45,31.49 46.34,31.49 v46.34,26.37
SW5  (via drill 0.2)
  Top 0.254: IC5.6 69.89,26.45 v69.89,26.37 | v50.69,29.7 43.78,29.7 43.78,28.93 43.82,28.93 U1.36
  Bottom 0.254: v69.89,26.37 50.69,26.37 v50.69,29.7
SW6  (via drill 0.2)
  Top 0.254: IC6.6 69.89,23.12 v69.89,23.3 | v49.66,30.46 42.27,30.46 U1.37
  Bottom 0.254: v69.89,23.3 49.66,23.3 v49.66,30.46
USB_D+
  Top 0.254: U1.20 40.29,21.85 40.29,18.38 41.04,18.38 R1.2
USB_D-
  Top 0.254: U1.19 39.75,21.85 39.75,18.38 38.28,18.38 R2.2
VCC  (via drill 0.2)
  Top 0.254: 71.42,39.17 IC1.5 | 71.42,39.17 73.98,39.17 73.98,37.02 71.42,37.02 IC2.5 71.42,35.84 73.98,35.84 73.98,33.73 71.42,33.73 IC3.5 71.42,32.51 73.73,32.51 73.73,30.37 71.42,30.37 IC4.5 71.42,29.18 73.47,29.18 73.47,27.04 71.42,27.04 IC5.5 71.42,25.86 73.47,25.86 73.47,23.71 71.42,23.71 IC6.5 71.42,22.53 73.73,22.53 73.73,16.9 76.29,16.9 | U1.44 38.83,30.45 38.83,30.03 | 38.83,25.4 U1.8 | 38.83,25.4 40.93,23.3 40.96,23.3 | R3.2 43.72,21.82 42.24,23.3 40.96,23.3 | 40.96,23.3 38.91,25.34 | 38.91,34.05 38.8,34.05 38.8,30.03 38.83,30.03 | 38.83,30.03 38.83,25.4 | 76.29,16.9 SV4.4 | 76.29,16.9 SV4.3 76.29,14.71 C11.1 | 62.21,39.17 71.42,39.17 | 29.89,13.57 29.44,13.57 29.44,12.54 35.33,12.54 C13.1
  Top 0.406: U2.2 27.14,5.47 27.14,9.47 27.14,11.2 C5.+ 27.14,11.19 v27.14,13.57 29.89,13.57 U4.4 U4.1 | 55.81,27.14 55.81,25.21 C9.1 50.65,25.21 C2.+ | 23.81,34.3 23.81,32.36 U3.1 U3.4 23.04,29.99 v23.04,28.67 | 23.81,34.3 23.73,34.38 C8.1 | 23.81,34.3 24,34.11 C1.+ 29.46,34.05 32.77,34.05 | 32.77,34.05 38.91,34.05 46.08,34.05 | 46.08,34.05 46.59,34.05 55.81,34.05 | 55.81,34.05 | v23.04,24.96 24.87,24.96 U$1.4 | v21.76,19.46 L1.1 | R5.2 32.77,34.05 | 46.08,34.05 46.08,35.71 C3.1 R4.2 | 55.81,34.05 C12.1 | 55.81,27.14 U$3.14 | 55.81,34.05 55.81,27.14 | 55.81,34.05 62.21,34.05 62.21,39.17
  Bottom 0.406: v23.04,28.67 v23.04,24.96 21.76,24.96 v21.76,19.46 21.76,13.57 v27.14,13.57
XTALIN
  Top 0.254: U1.6 33.54,26.4 33.54,13.82 33.08,13.82 U4.3

### Text on the board
Top: EDUBRM